# EAGLE design main (EAGLE 9.5.1)
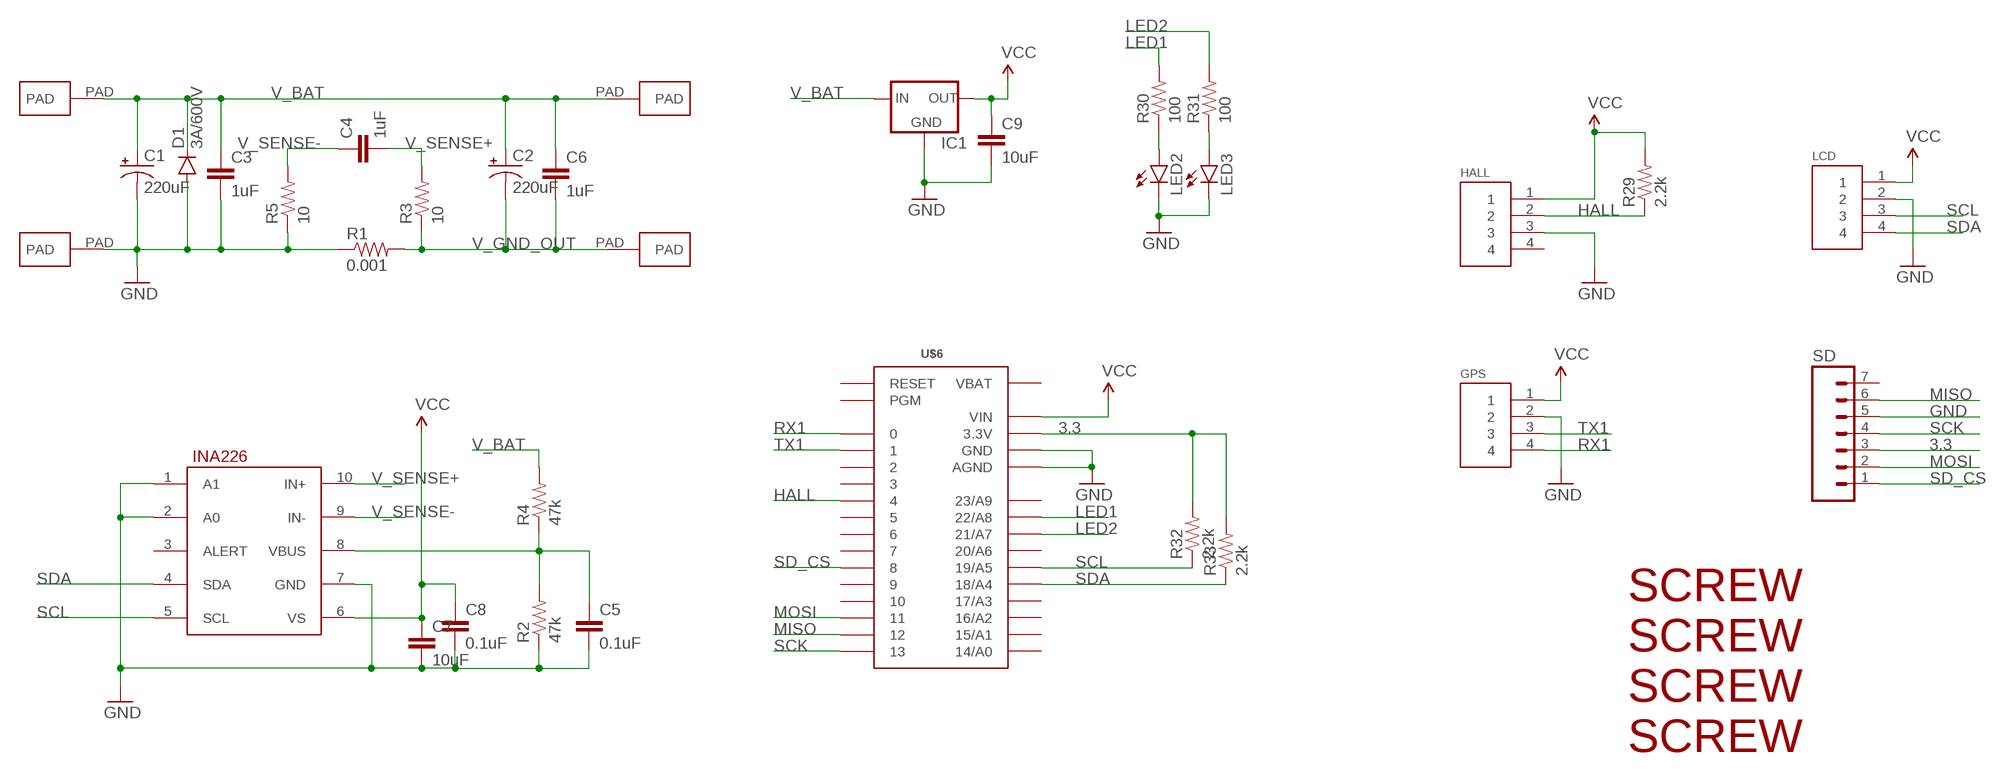
[diagram p0: schematic, sheet 1]

## Parts
C1  220uF  CAP_POLPTH4  [CPOL-RADIAL-1000UF-25V]
C2  220uF  CAP_POLPTH4  [CPOL-RADIAL-1000UF-25V]
C3  1uF  CAP1206  [1206]
C4  1uF  CAP1206  [1206]
C5  0.1uF  CAP0603-CAP  [0603-CAP]
C6  1uF  CAP1206  [1206]
C7  10uF  CAP0805  [0805]
C8  0.1uF  CAP0603-CAP  [0603-CAP]
C9  10uF  CAP0805  [0805]
D1  3A/600V  DIODEES3J  [SMC]
GPS  GPS  HEADER4VALULOK  [4PINVALULOK]
HALL  HEADER4VALULOK  [4PINVALULOK]
IC1  V_REG_78XXSINK  [TO220-IGO]
LCD  GPS  HEADER4VALULOK  [4PINVALULOK]
LED2  LED1206  [LED-1206]
LED3  LED1206  [LED-1206]
R1  0.001  RESISTOR2512  [R2512]
R2  47k  RESISTOR0603-RES  [0603-RES]
R3  10  RESISTOR0603-RES  [0603-RES]
R4  47k  RESISTOR0603-RES  [0603-RES]
R5  10  RESISTOR0603-RES  [0603-RES]
R29  2.2k  RESISTOR0603-RES  [0603-RES]
R30  100  RESISTOR0603-RES  [0603-RES]
R31  100  RESISTOR0603-RES  [0603-RES]
R32  2.2k  RESISTOR0603-RES  [0603-RES]
R33  2.2k  RESISTOR0603-RES  [0603-RES]
SD  M07  [1X07]
U$1  INA226  [PSOP-10]
U$2  PAD  [PAD]
U$3  PAD  [PAD]
U$4  PAD  [PAD]
U$5  PAD  [PAD]
U$6  TEENSY_3.0_BASIC  [TEENSY_3.0_BASIC]
U$13  SCREW  [M3HOLE]
U$14  SCREW  [M3HOLE]
U$15  SCREW  [M3HOLE]
U$16  SCREW  [M3HOLE]

## Nets
3.3: R32.2 R33.2 SD.3 U$6.3.3V U$6.3.3V1(3.3V)
GND: C1.- C3.2 C5.2 C7.2 C8.2 C9.2 D1.A GPS.2 HALL.3 IC1.GND LCD.2 LED2.C LED3.C R1.1 R2.1 R5.1 SD.5 U$1.1(A1) U$1.2(A0) U$1.7(GND) U$3.PAD U$6.AGND U$6.GND U$6.GND1(GND)
HALL: HALL.2 R29.1 U$6.4
LED1: R30.2 U$6.22/A8
LED2: R31.2 U$6.21/A7
MISO: SD.6 U$6.12
MOSI: SD.2 U$6.11
N$1: C5.1 R2.2 R4.1 U$1.8(VBUS)
N$2: LED2.A R30.1
N$20: LED3.A R31.1
RX1: GPS.4 U$6.0
SCK: SD.4 U$6.13
SCL: LCD.3 R32.1 U$1.5(SCL) U$6.19/A5
SD_CS: SD.1 U$6.8
SDA: LCD.4 R33.1 U$1.4(SDA) U$6.18/A4
TX1: GPS.3 U$6.1
V_BAT: C1.+ C2.+ C3.1 C6.1 D1.C IC1.IN R4.2 U$2.PAD U$4.PAD
V_GND_OUT: C2.- C6.2 R1.2 R3.1 U$5.PAD
V_SENSE+: C4.2 R3.2 U$1.10(IN+)
V_SENSE-: C4.1 R5.2 U$1.9(IN-)
VCC: C7.1 C8.1 C9.1 GPS.1 HALL.1 IC1.OUT LCD.1 R29.2 U$1.6(VS) U$6.VIN
Unconnected: HALL.4 SD.7 U$1.3(ALERT) U$6.2 U$6.3 U$6.5 U$6.6 U$6.7 U$6.9 U$6.10 U$6.14/A0 U$6.15/A1 U$6.16/A2 U$6.17/A3 U$6.20/A6 U$6.23/A9 U$6.PGM U$6.RESET

## Power pins joined to a net without a drawn wire
VBAT: U$6.VBAT

## Library data of the parts
C1 C2 = SparkFun-Capacitors:CAP_POL: Capacitor Polarized These are standard SMD and PTH capacitors. Normally 10uF, 47uF, and 100uF in electrolytic and tantalum varieties. Always verify the external diameter of the through hole cap, it varies with capacity, voltage, and manufacturer. The EIA devices should be standard.
C3 C4 C6 = SparkFun-Capacitors:CAP: Capacitor Standard 0603 ceramic capacitor, and 0.1" leaded capacitor.
C5 C7-C9 = SparkFun-Passives:CAP: Capacitor Standard 0603 ceramic capacitor, and 0.1" leaded capacitor.
D1 = SparkFun-DiscreteSemi:DIODE: Diode These are standard reverse protection diodes and small signal diodes. SMA package can handle up to about 1A. SOD-323 can handle about 200mA. What the SOD-323 package when ordering, there are some mfgs out there that are 5-pin packages.; PROD_ID: DIO-12441
GPS HALL LCD = Custom_old:HEADER4
IC1 = SparkFun-PowerIC:V_REG_78XX: Voltage Regulator Standard 7805 5V regulator. IGO (Input Ground Output). Spark Fun Electronics SKU : COM-00107
LED2 LED3 = SparkFun-LED:LED: LEDs Standard schematic elements and footprints for 5mm, 3mm, 1206, and 0603 sized LEDs. 5mm - Spark Fun Electronics SKU : COM-00529 (and others)
R1 = SparkFun-Resistors:RESISTOR: Resistor Basic schematic elements and footprints for 0603, 1206, and PTH resistors.
R2-R5 R29-R33 = SparkFun-Passives:RESISTOR: Resistor Basic schematic elements and footprints for 0603, 1206, and PTH resistors.
SD = SparkFun-Connectors:M07: Header 7 Standard 7-pin 0.1" header. Use with straight break away headers (SKU : PRT-00116), right angle break away headers (PRT-00553), swiss pins (PRT-00743), machine pins (PRT-00117), and female headers (PRT-00115). NOTES ON THE VARIANTS LOCK and LOCK_LONGPADS... This footprint was designed to help hold the alignment of a through-hole component (i.e. 7-pin header) while soldering it into place. You may notice that each hole has been shifted either up or down by 0.005 of an inch from it's more standard position (which is usually a perfectly straight line). This slight alteration caused the pins (the squares in the middle) to touch the edges of the holes. Because they are alternating, it causes a "brace" to hold the header in place. 0.005 has proven to be the perfect amount of "off-center" position when using our standard breakaway headers. Although looks a little odd when you look at the bare footprint, once you have a header in there, the alteration is very hard to notice. Also, if you push a header all the way into place, it is covered up entirely on the bottom side. This idea of altering the position of holes to aid alignment will be further integrated into the Sparkfun Library for other footprints. It can help hold any component with 3 or more connection pins.
U$1 = Custom_old:INA226
U$2-U$5 = Custom_old:PAD
U$6 = Teensy3.0:TEENSY_3.0_BASIC: Basic Teensy 3.0 with none of the 'inner' pins enabled. See '+4', 'AllAnalogPins", and 'AllPins' packages for additional pin holes, as needed.
U$13-U$16 = Custom_old:SCREW

## Board
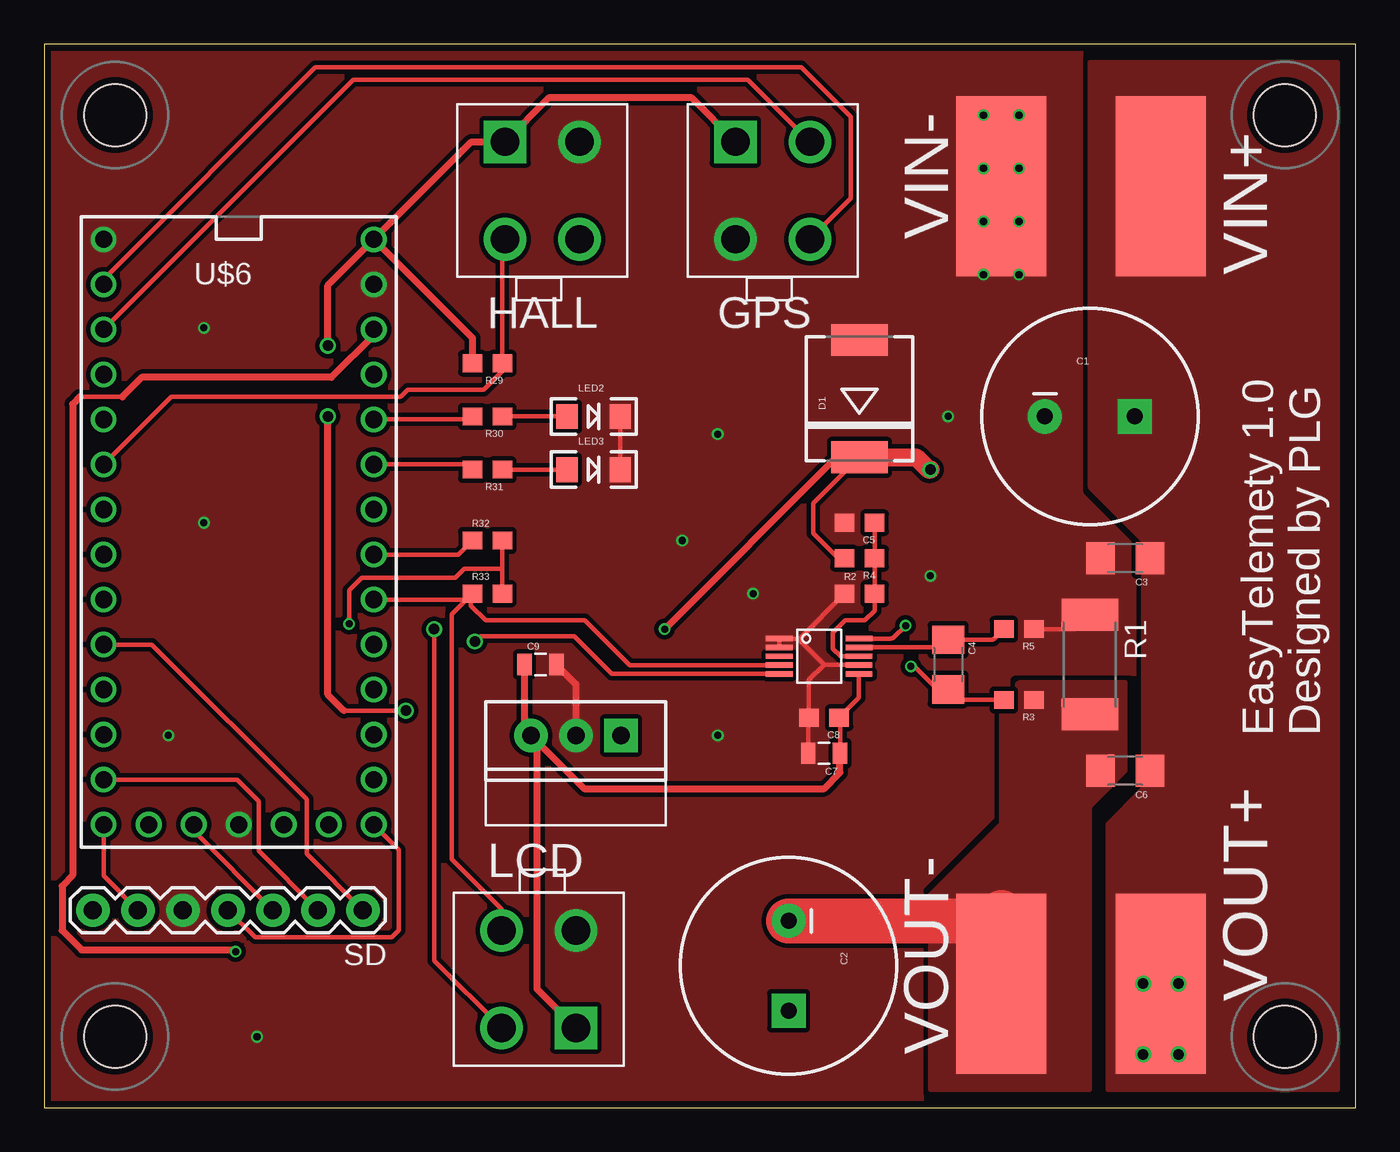
[diagram p1: board, top side]
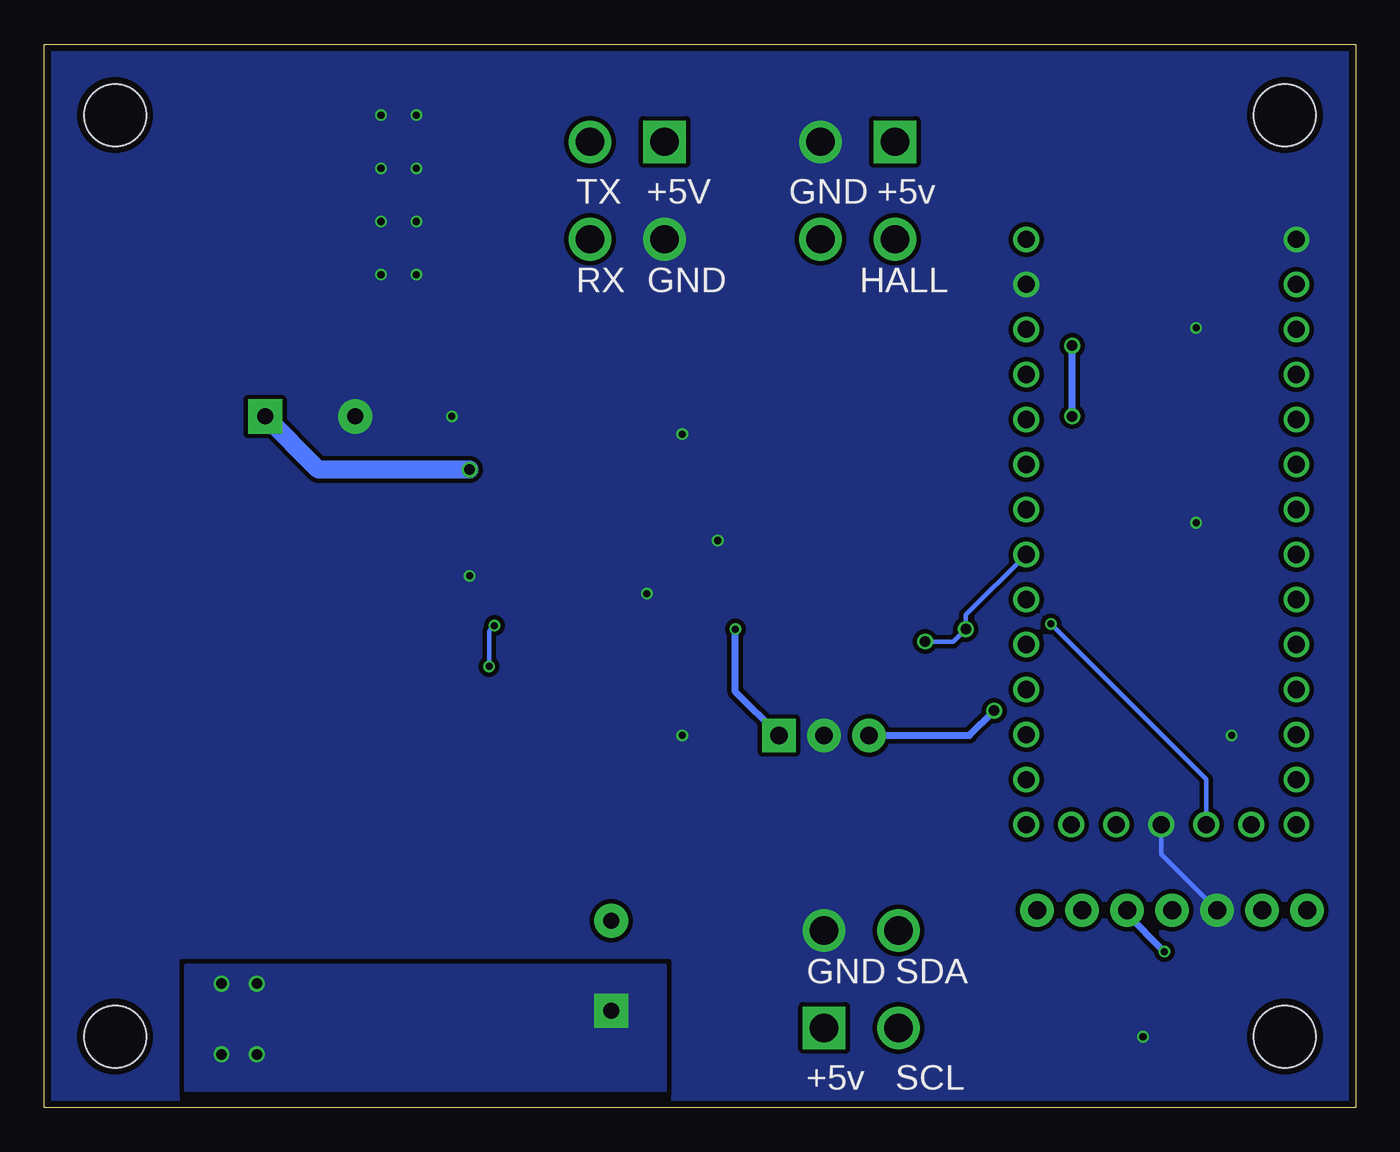
[diagram p2: board, bottom side, seen from below]

Size 74 x 60 mm. Coordinates in mm from the lower left corner, seen from the top.
Outline: 0,0 74,0 74,60 0,60 0,0
Copper layers (1*16): Top 0.035559375mm / dielectric 1.6mm / Bottom 0.035559375mm
Design rules "PATRICK-2lyr": minimum track width 6mil, minimum drill 10mil, track to track 6mil, track to pad 6mil, pad to pad 6mil, via to via 6mil, smd to smd 6mil, copper to edge 15mil, drill to drill 6mil, minimum pad ring 5mil, minimum via ring 5mil, stop-mask expansion 2.5mil, vias tented up to drill 25mil, thermal gap 10mil

### Footprints (pad centres in the part's own frame; a part is rotated, then mirrored left to right if it is on the bottom)
CPOL-RADIAL-1000UF-25V = drill 0.9 pad 1.93 square: + 2.54,0 | drill 0.9 pad 1.93: - -2.54,0
1206 = smd 1.6 x 1.8: 1 -1.4,0; 2 1.4,0
0603-CAP = smd 1.1 x 1: 1 -0.85,0; 2 0.85,0
0805 = smd 0.8 x 1.2: 1 -0.9,0; 2 0.9,0
SMC = smd 1.778 x 3.175: A 3.302,0; C -3.302,0
4PINVALULOK = drill 1.6 square: 1 0,5.5 | drill 1.6: 2 0,0; 3 4.2,5.5; 4 4.2,0
TO220-IGO = drill 1 pad 1.88: GND 0,0; OUT 2.54,0 | drill 1 pad 1.88 square: IN -2.54,0
LED-1206 = smd 1.2 x 1.4: A -1.5,0; C 1.5,0
R2512 = smd 1.8 x 3.2: 1 -2.8,0; 2 2.8,0
0603-RES = smd 1.1 x 1: 1 -0.85,0; 2 0.85,0
1X07 = drill 1.016 pad 1.88: 1 0,0; 2 2.54,0; 3 5.08,0; 4 7.62,0; 5 10.16,0; 6 12.7,0; 7 15.24,0
PSOP-10 = smd 1.5 x 0.3: 1 0,1; 2 0,0.5; 3 0,0; 4 0,-0.5; 5 0,-1; 6 4.5,-1; 7 4.5,-0.5; 8 4.5,0; 9 4.5,0.5; 10 4.5,1
PAD = smd 10.16 x 5.08: PAD 0,0
TEENSY_3.0_BASIC = drill 0.965: 0 -7.62,13.97; 1 -7.62,11.43; 2 -7.62,8.89; 3 -7.62,6.35; 3.3V 7.62,11.43; 3.3V1 -2.54,-16.51; 4 -7.62,3.81; 5 -7.62,1.27; 6 -7.62,-1.27; 7 -7.62,-3.81; 8 -7.62,-6.35; 9 -7.62,-8.89; 10 -7.62,-11.43; 11 -7.62,-13.97; 12 -7.62,-16.51; 13 7.62,-16.51; 14/A0 7.62,-13.97; 15/A1 7.62,-11.43; 16/A2 7.62,-8.89; 17/A3 7.62,-6.35; 18/A4 7.62,-3.81; 19/A5 7.62,-1.27; 20/A6 7.62,1.27; 21/A7 7.62,3.81; 22/A8 7.62,6.35; 23/A9 7.62,8.89; AGND 7.62,13.97; GND -7.62,16.51; GND1 0,-16.51; PGM 2.54,-16.51; RESET 5.08,-16.51; VBAT -5.08,-16.51; VIN 7.62,16.51
M3HOLE = hole 3.5: 0,0

### Placement (x,y rotation side)
C1  59,39 0 top
C2  42,8 270 top
C3  61,31 180 top
C4  51,25 270 top
C5  46,33 180 top
C6  61,19 180 top
C7  44,20 180 top
C8  44,22 180 top
C9  28,25 0 top
D1  46,40 90 top
GPS  39,49 0 top
HALL  26,49 0 top
IC1  30,21 180 top
LCD  30,10 180 top
LED2  31,39 0 top
LED3  31,36 0 top
R1  59,25 270 top
R2  46,29 0 top
R3  55,23 180 top
R4  46,31 180 top
R5  55,27 180 top
R29  25,42 180 top
R30  25,39 180 top
R31  25,36 180 top
R32  25,32 0 top
R33  25,29 0 top
SD  17.98,11.14 180 top
U$1  41.47,25.47 0 top
U$2  63,7 90 top
U$3  54,52 90 top
U$4  63,52 90 top
U$5  54,7 90 top
U$6  10.97,32.48 0 top
U$13  70,4 0 top
U$14  70,56 0 top
U$15  4,56 0 top
U$16  4,4 0 top

### Tracks (layer width: path | path; a pad name or v marks a point on that pad's centre or on a via)
3.3  (via drill 0.4)
  Top 0.254: SD.3 8.43,15.61 U$6.3.3V1 | R33.2 25.85,30.4 | 25.85,30.4 R32.2 | v17.2,27.3 17.2,29.2 17.9,29.9 23.2,29.9 23.7,30.4 25.85,30.4 | 4.4,40.1 2,40.1
  Top 0.406: U$6.3.3V 18.59,43.59 16.2,41.2 5.5,41.2 4.4,40.1 | 2,40.1 1.6,39.7 1.6,13.1 1,12.5 1,10 2.1,8.9 10.8,8.9 v10.8,8.8
  Bottom 0.254: U$6.3.3V1 8.43,18.53 v17.2,27.3
  Bottom 0.406: v10.8,8.8 12.9,10.9 SD.3
GND  (via drill 0.4)
  Top 0.254: R5.1 58.09,27 arc45 58.27,27.07 R1.1 | R2.1 42.62,26.47 | 42.62,26.47 U$1.1 U$1.2 | U$1.7 45.94,25 44,25 | 44,25 42.62,26.38 42.62,26.47 | LED2.C LED3.C | 44,25 43.15,24.15 C8.2 43.1,21.95 C7.2
  Top 0.406: C9.2 30,23.9 IC1.GND
  Bottom 0.254: SD.5 10.97,14.29 U$6.GND1
  other vias: 53,56 55,56 55,53 53,53 55,50 53,50 55,47 53,47 38,38 36,32 51,39 50,30 40,29 12,4 9,33 9,44 38,21 7,21
  pour Top (isolate 0.254, rank 6, no thermals): 0,60 0,0 74,0 74,60
  pour Bottom (isolate 0.254, rank 5, no thermals): 0,60 0,0 74,0 74,60
HALL
  Top 0.254: HALL.2 25.85,48.85 R29.1 25.85,41.55 24.8,40.5 20.5,40.5 20.1,40.1 7.16,40.1 U$6.4
LED1
  Top 0.254: U$6.22/A8 23.98,38.83 R30.2
LED2
  Top 0.254: U$6.21/A7 23.86,36.29 R31.2
MISO
  Top 0.254: U$6.12 3.35,13.07 SD.6
MOSI
  Top 0.254: SD.2 12.1,14.48 12.1,17.3 10.89,18.51 U$6.11
N$1
  Top 0.254: U$1.8 44.93,25.47 44.5,25.9 44.5,26.8 45.2,27.5 46.3,27.5 46.85,28.05 R2.2 R4.1 C5.1
N$2
  Top 0.254: R30.1 LED2.A
N$20
  Top 0.254: R31.1 LED3.A
RX1
  Top 0.254: GPS.4 45.5,51.3 45.5,55.9 42.7,58.7 15.3,58.7 3.35,46.75 U$6.0
SCK
  Top 0.254: SD.4 11.9,9.6 19.6,9.6 20,10 20,14.56 U$6.13
SCL  (via drill 0.6)
  Top 0.254: U$6.19/A5 23.36,31.21 R32.1 | LCD.3 22,8.3 v22,27 | U$1.5 32.03,24.47 29.9,26.6 24.6,26.6 v24.3,26.3
  Bottom 0.254: U$6.19/A5 22,27.8 v22,27 22.7,26.3 v24.3,26.3
SD_CS
  Top 0.254: SD.1 14.8,14.32 14.8,17.4 6.07,26.13 U$6.8
SDA
  Top 0.254: U$6.18/A4 23.82,28.67 | 23.82,28.67 24.07,28.93 | R33.1 24.07,28.93 | 23.82,28.67 23,27.85 23,14 25.8,11.2 LCD.4 | U$1.4 33.03,24.97 30.5,27.5 24.9,27.5 24.07,28.32 24.07,28.93
TX1
  Top 0.254: GPS.3 39.7,58 17.44,58 U$6.1
V_BAT  (via drill 0.4, 0.6)
  Top 0.254: D1.C 43.4,34.1 43.4,32.4 44.8,31 R4.2
  Top 0.406: v35,27 44.7,36.7 D1.C
  Top 1.016: D1.C 49.2,36.7 49.9,36 v50,36
  Bottom 0.406: IC1.IN 35,23.46 v35,27
  Bottom 1.016: v50,36 58.54,36 C1.+
  other vias: 62,7 62,3 64,3 64,7
  pour Top (isolate 0.254, no thermals): 59,57 59,35.11 arc45 59.07,34.93 62,32 62,18.11 arc-45 61.93,17.93 60,16 60,1 73,1 73,59 59,59
  pour Bottom (isolate 0.254, no thermals): 39,7 39,1 66,1 66,8 39,8
V_GND_OUT
  Top 0.254: 58.7,22 arc45 58.87,22.07 R1.2
  Top 2.54: C2.- 53.54,10.54 54,11 54,6 54,5
  pour Top (isolate 0.254, rank 2, no thermals): 61,24 55.11,24 arc45 54.93,23.93 54,23 54,16.11 arc-45 53.93,15.93 50,12 50,1 59,1 59,16.89 arc-45 59.07,17.07 60,18 60.93,18.93 arc45 61,19.11
V_SENSE+  (via drill 0.4)
  Top 0.254: R3.2 51.7,23 arc-45 51.53,23.07 C4.2 50.51,23.6 arc-45 50.33,23.67 49,25 v48.9,24.9 | v48.6,27.2 47.94,26.54 arc-45 47.77,26.47 U$1.10
  Bottom 0.254: v48.9,24.9 48.9,26.8 arc45 48.83,26.97 v48.6,27.2
V_SENSE-
  Top 0.254: R5.2 53.62,26.47 arc-45 53.45,26.4 C4.1 50.64,26.04 arc-45 50.47,25.97 U$1.9
VCC  (via drill 0.6)
  Top 0.254: C8.1 44.92,22.07 | 44.92,22.07 45.97,23.12 U$1.6 | C7.1 44.92,20.02 44.92,22.07 | v20.4,22.4 16.9,22.4
  Top 0.406: IC1.OUT 27.1,21.36 C9.1 | IC1.OUT 27.8,20.66 27.8,6.7 LCD.1 | U$6.VIN 24.1,54.5 HALL.1 28.5,57 36.5,57 GPS.1 | U$6.VIN 24.15,43.43 R29.2 | 16.9,22.4 16,23.3 v16,39 | v16,43 16,46.4 U$6.VIN | IC1.OUT 30.46,18 44,18 44.9,18.9 C7.1
  Bottom 0.406: IC1.OUT 21.8,21 v20.4,22.4 | v16,39 v16,43

### Text on the board
tPlace: VIN- | VIN+ | HALL | GPS | EasyTelemety 1.0 / Designed by PLG | LCD | VOUT+ | VOUT-
bPlace: +5v | GND | +5V | TX | HALL | GND | RX | SDA | GND | SCL | +5v